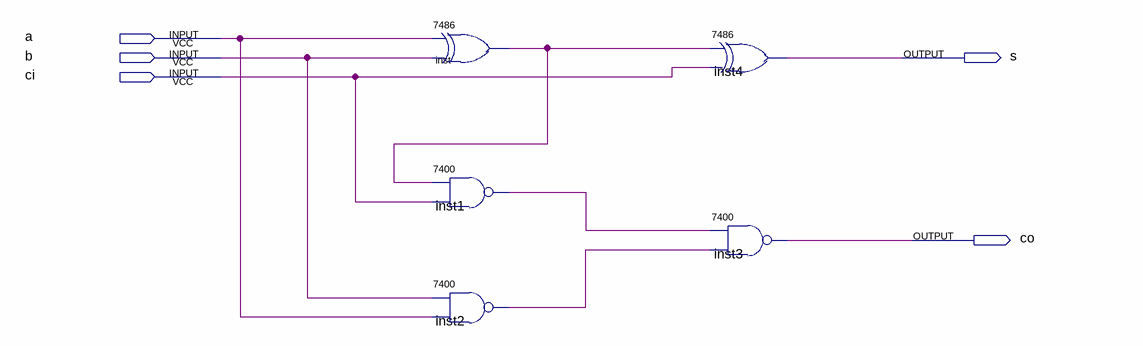
[diagram p0: schematic sheet]
// Quartus schematic 2.bdf as structural Verilog: 5 symbols, 5 pins
module \2  (
  input  a,
  input  b,
  input  ci,
  output s,
  output co
);

  wire inst1_1, inst2_1, inst_1;

  \7486  inst (.\2 (a), .\3 (b), .\1 (inst_1));
  \7400  inst1 (.\3 (ci), .\2 (inst_1), .\1 (inst1_1));
  \7400  inst2 (.\3 (a), .\2 (b), .\1 (inst2_1));
  \7486  inst4 (.\2 (inst_1), .\3 (ci), .\1 (s));
  \7400  inst3 (.\3 (inst2_1), .\2 (inst1_1), .\1 (co));
endmodule
